# EAGLE schematic tubeboard (EAGLE 9.4.2)
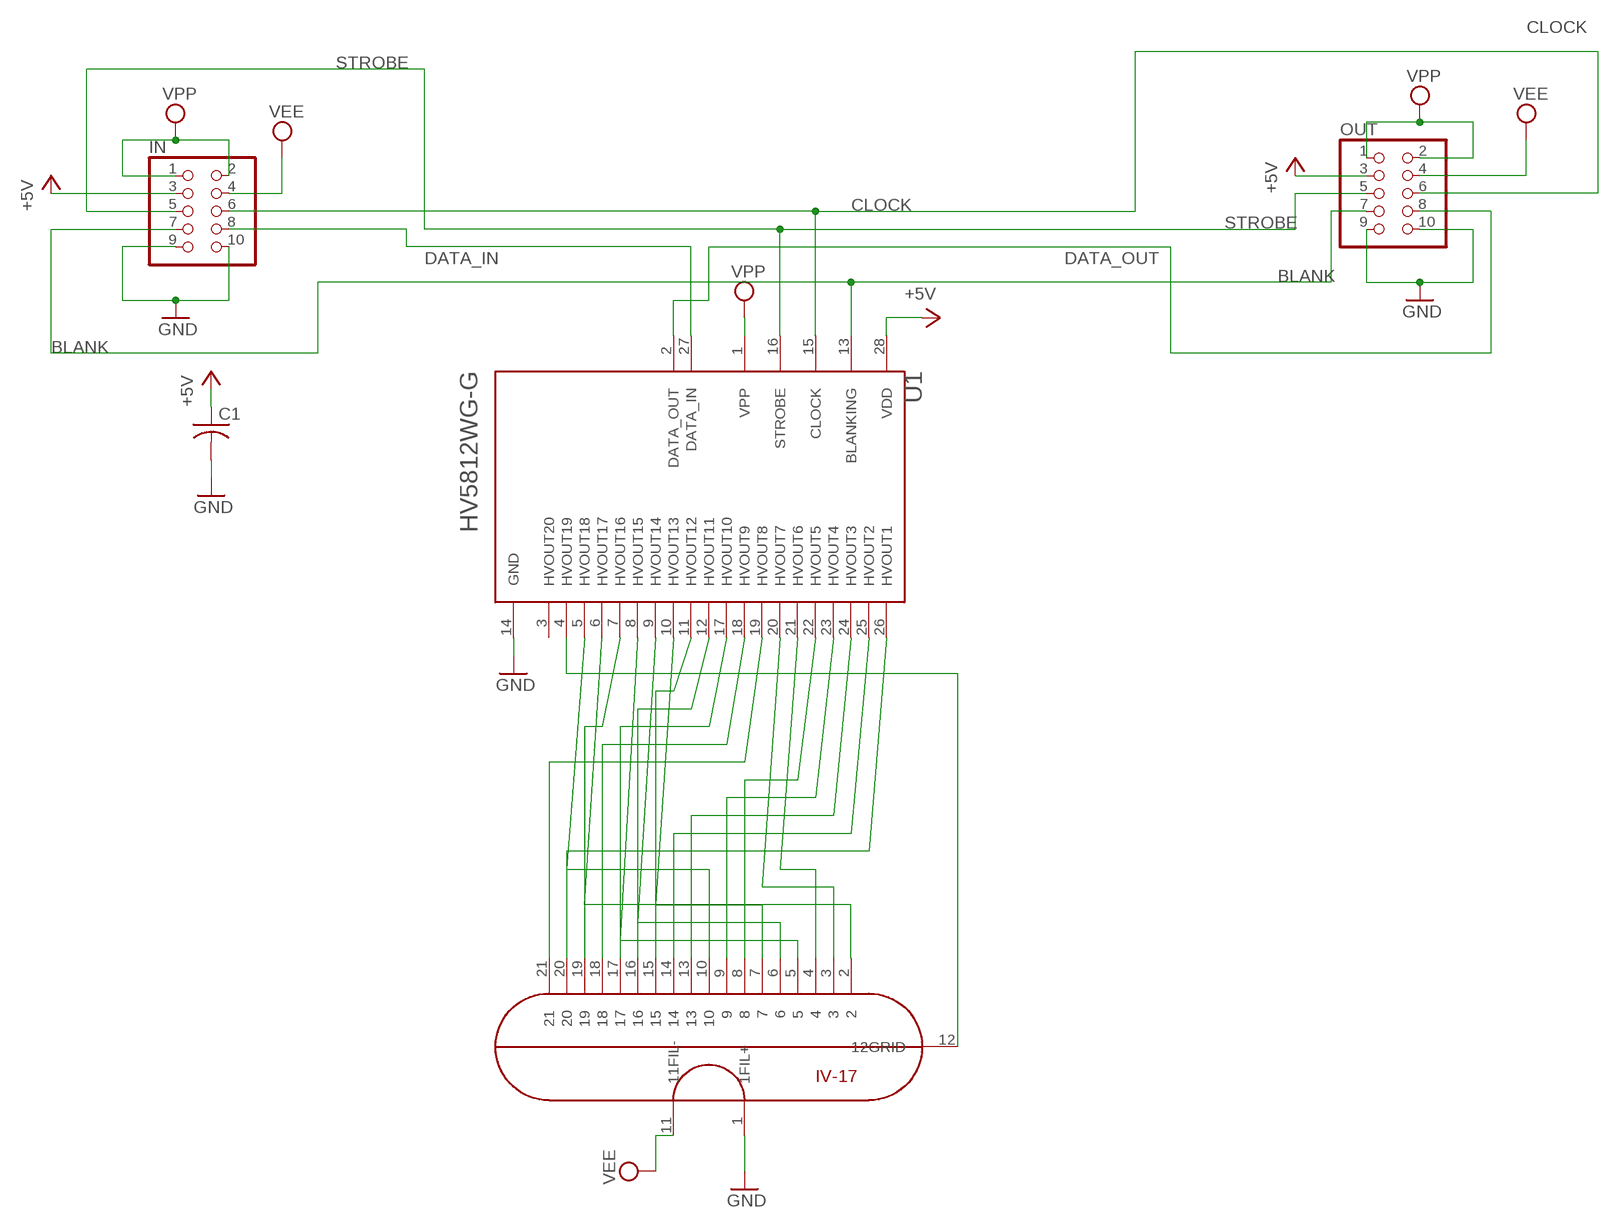
[diagram p0: schematic, sheet 1]

## Parts
C1  C-USC0805  [C0805]
IN  PINHD-2X5/90  [2X05/90]
IV17  IV17  [NIXIE-22]
OUT  PINHD-2X5/90  [2X05/90]
U1  MICROCHIP_HV5812WG-GMICROCHIP_HV5812WG-G_0_0  [MICROCHIP_HV5812WG-G_0]

## Nets
+5V: C1.1 IN.3 OUT.3 U1.28(VDD)
BLANK: IN.7 OUT.7 U1.13(BLANKING)
CLOCK: IN.6 OUT.6 U1.15(CLOCK)
DATA_IN: IN.8 U1.27(DATA_IN)
DATA_OUT: OUT.8 U1.2(DATA_OUT)
GND: C1.2 IN.9 IN.10 IV17.1(1FIL+) OUT.9 OUT.10 U1.14(GND)
N$1: IV17.20 U1.26(HVOUT1)
N$2: IV17.14 U1.25(HVOUT2)
N$3: IV17.13 U1.24(HVOUT3)
N$4: IV17.9 U1.23(HVOUT4)
N$5: IV17.8 U1.22(HVOUT5)
N$6: IV17.4 U1.21(HVOUT6)
N$7: IV17.3 U1.20(HVOUT7)
N$8: IV17.21 U1.19(HVOUT8)
N$9: IV17.18 U1.18(HVOUT9)
N$10: IV17.17 U1.17(HVOUT10)
N$11: IV17.16 U1.12(HVOUT11)
N$12: IV17.15 U1.11(HVOUT12)
N$13: IV17.7 U1.10(HVOUT13)
N$14: IV17.6 U1.9(HVOUT14)
N$15: IV17.5 U1.8(HVOUT15)
N$16: IV17.19 U1.7(HVOUT16)
N$17: IV17.2 U1.6(HVOUT17)
N$18: IV17.10 U1.5(HVOUT18)
N$19: IV17.12(12GRID) U1.4(HVOUT19)
STROBE: IN.5 OUT.5 U1.16(STROBE)
VEE: IN.4 IV17.11(11FIL-) OUT.4
VPP: IN.1 IN.2 OUT.1 OUT.2 U1.1(VPP)
Unconnected: U1.3(HVOUT20)

## Library data of the parts
C1 = rcl:C-US: CAPACITOR, American symbol; SPICEPREFIX: C
IN OUT = pinhead:PINHD-2X5: PIN HEADER
IV17 = XXXXXXtube supl:IV17
U1 = Microchip - HV5812WG-G:MICROCHIP_HV5812WG-G: 20-Channel Serial-Input Vacuum Fluorescent Display Driver for Anode or Grid; CENTROID_NOT_SPECIFIED: No; DATASHEET: http://www.mouser.com/ds/2/268/HV5812%20C072413-767325.pdf; DIGIKEY_DESCRIPTION: IC DISPLAY DVR 20CH 80V 28SOI; DIGIKEY_PART_NUMBER: HV5812WG-GCT-ND; IPC_LAND_PATTERN_NAME: SOIC127P1030X240-28; LEAD_FREE: yes; MF: Microchip; MOUSER_PART_NUMBER: 689-HV5812WG-G; MPN: HV5812WG-G; PACKAGE: SOIC28; PREFIX: U; ROHS: yes; TEMPERATURE_RANGE_HIGH: +125°C; TEMPERATURE_RANGE_LOW: -40°C